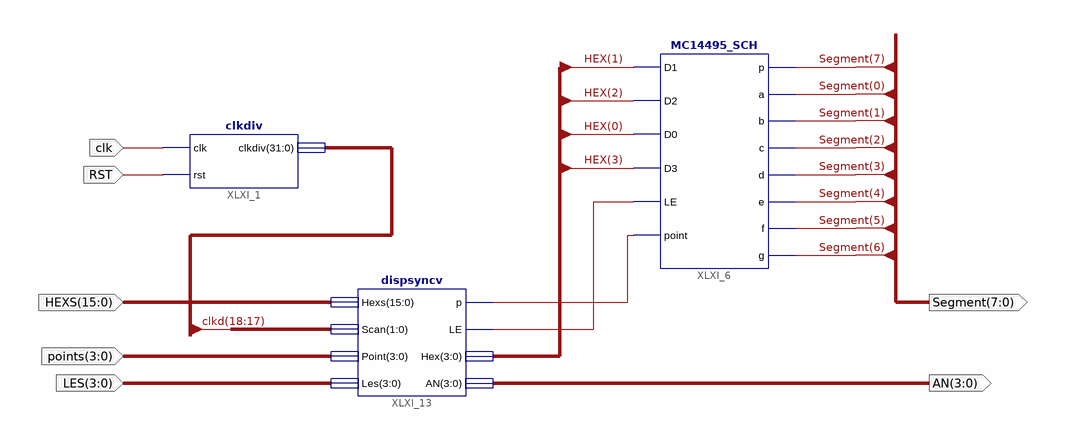
[diagram p0: schematic sheet 1]
// Xilinx ISE schematic DispNum.sch (kintex7) as structural Verilog: 3 symbols, 7 ports
module DispNum (
  input  [15:0] HEXS,
  input  [3:0] LES,
  input  [3:0] points,
  input  clk,
  input  RST,
  output [3:0] AN,
  output [7:0] Segment
);

  wire XLXN_12, XLXN_13;
  wire [3:0] HEX;
  wire [31:0] clkd;

  clkdiv XLXI_1 (.clk(clk), .rst(RST), .clkdiv(clkd));
  MC14495_SCH XLXI_6 (
    .D1(HEX[1]), .D2(HEX[2]), .D0(HEX[0]), .D3(HEX[3]), .LE(XLXN_13), .point(XLXN_12), .p(Segment[7]),
    .a(Segment[0]), .b(Segment[1]), .c(Segment[2]), .d(Segment[3]), .e(Segment[4]), .f(Segment[5]),
    .g(Segment[6]));
  dispsyncv XLXI_13 (
    .Hexs(HEXS), .Scan(clkd[18:17]), .Point(points), .Les(LES), .p(XLXN_12), .LE(XLXN_13), .Hex(HEX), .AN(AN));
endmodule
